# Altium project Gimbal.PrjPcb
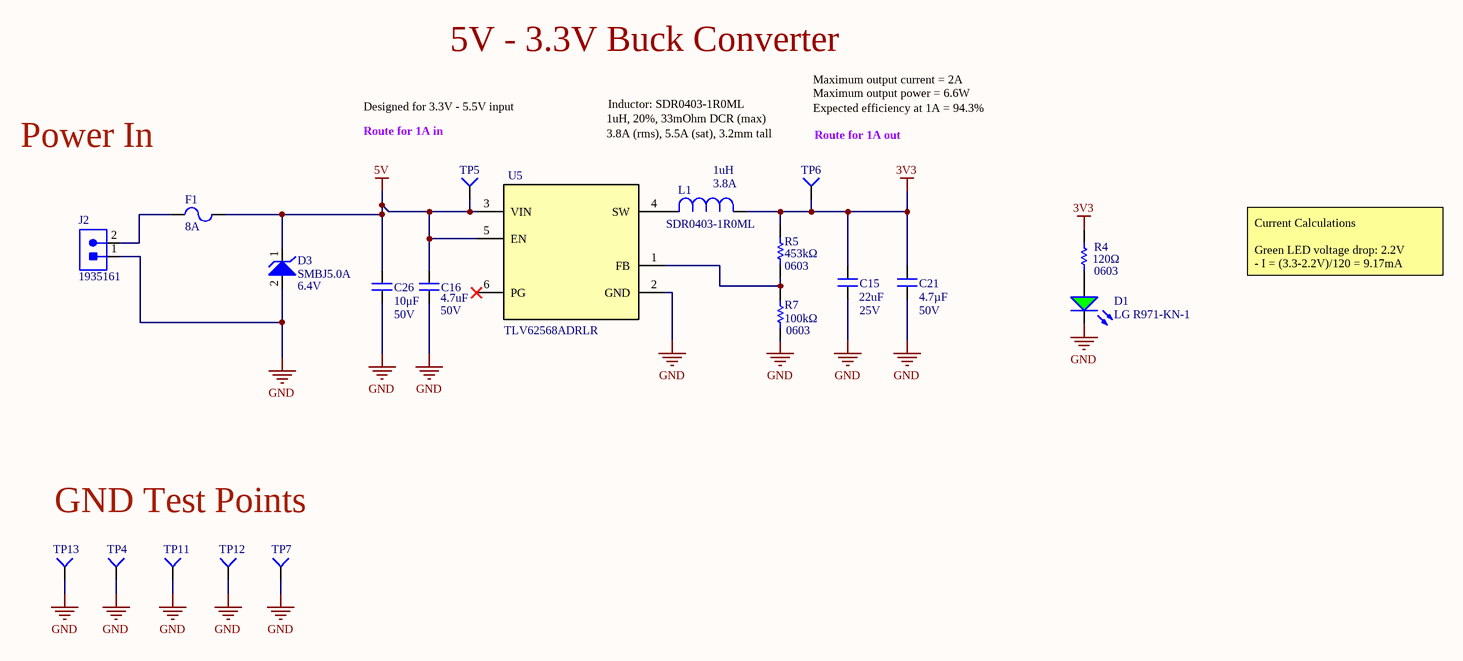
[diagram p0: SH1 - POWER.SchDoc]
5 sheets, 96 parts. Net scope: flat (ports and power ports of the same name join across sheets).
Board file: Gimbal.PcbDoc
Sheets:
  SH1 - POWER.SchDoc
  SH2 - CONNECTORS.SchDoc
  SH3 - SENSORS.SchDoc
  SH5 - MICROCONTROLLER.SchDoc
  SH6 - CAN.SchDoc

## Sheet SH1 - POWER.SchDoc: Power
size B; CheckedBy: Lance Bantoto; Author: Aidan Gratton; DrawnBy: Aidan Gratton; Engineer: Aidan Gratton; Organization: UW Robotics; Address1: 200 University Avenue; Address2: Waterloo; Address3: Ontario; Address4: Canada N2L 3G6; Revision: 2; SheetNumber: 1; SheetTotal: 6

### Parts
C15  Voltage: 25V  Capacitance: 22uF  [CAPC3225X270N]  (hidden comment: GRM32ER71E226ME15K)
C16  Voltage Rating: 50V  Capacitance: 4.7uF  [CAP1206]  (hidden comment: 4.7µF)
C21  4.7µF  Voltage: 50V  [CAP1206]
C26  value 10μF  Voltage Rating: 50V  [CAP1206]  (hidden comment: 10uF)
D1  LG R971-KN-1  [LED_0805_GREEN]
D3  Reverse Breakdown Voltage: 6.4V  [SMBJ5.0A]  (hidden comment: TVS_DIODE_UNIDIR_5V)
F1  Current Rating: 8A  [FUSE_1206]  (hidden comment: FUSE_8A_1206)
J2  1935161  [1935161]
L1  value 1uH  Manufacturer Part Number 1: SDR0403-1R0ML  Current Rating: 3.8A  [IND_BOURNS_SDR04]  (hidden comment: IND_1uH_3.8A)
R4  value 120Ω  Case Code (Imperial): 0603  [RESC0603(1608)_N]  (hidden comment: RES_120Ω_0603)
R5  value 453kΩ  Case Code (Imperial): 0603  [RESC0603(1608)_N]  (hidden comment: RES_453kΩ_0603)
R7  value 100kΩ  Case Code (Imperial): 0603  [RESC0603(1608)_N]  (hidden comment: RES_100kΩ_0603_1%)
TP4  TESTPOINT_1MM_SQUARE  [TESTPOINT_SQUARE_1MM]  (value not drawn)  (no BOM)
TP5  TESTPOINT_SMD_LOOP  [S1751-46R]  (value not drawn)
TP6  TESTPOINT_SMD_LOOP  [S1751-46R]  (value not drawn)
TP7  TESTPOINT_1MM_SQUARE  [TESTPOINT_SQUARE_1MM]  (value not drawn)  (no BOM)
TP11  TESTPOINT_1MM_SQUARE  [TESTPOINT_SQUARE_1MM]  (value not drawn)  (no BOM)
TP12  TESTPOINT_1MM_SQUARE  [TESTPOINT_SQUARE_1MM]  (value not drawn)  (no BOM)
TP13  TESTPOINT_SMD_LOOP  [S1751-46R]  (value not drawn)
U5  TLV62568ADRLR  [SOT50P160X60-6N]

### Nets
3V3: C15.2 C21.2 L1.2 R4.2 R5.2 TP6.1(=value)
5V: C16.2 C26.2 D3.1 F1.2 TP5.1(=value) U5.3(VIN) U5.5(EN)
GND: C15.1 C16.1 C21.1 C26.1 D1.2(K) D3.2 J2.1 R7.1 TP4.1(=value) TP7.1(=value) TP11.1(=value) TP12.1(=value) TP13.1(=value) U5.2(GND)
NetD1_1: D1.1(A) R4.1
NetF1_1: F1.1 J2.2
NetL1_1: L1.1 U5.4(SW)
NetR5_1: R5.1 R7.2 U5.1(FB)

Not connected (* = marked no-connect by the designer): U5 6(PG)*

### Notes on the sheet
- 5V - 3.3V Buck Converter
- Maximum output current = 2A
- Power In
- Designed for 3.3V - 5.5V input
- (near TP5) Route for 1A in
- 1uH, 20%, 33mOhm DCR (max)
- 3.8A (rms), 5.5A (sat), 3.2mm tall
- Inductor: SDR0403-1R0ML
- Maximum output power = 6.6W
- Expected efficiency at 1A = 94.3%
- (near TP6) Route for 1A out
- Current Calculations
  Green LED voltage drop: 2.2V
  - I = (3.3-2.2V)/120 = 9.17mA
- GND Test Points
- Title:
- Project:
- Date:
- Rev:
- Checker:
- Engineer:
- Sheet:
- of

### Library data of the parts
C15 = GRM32ER71E226ME15K: CAP CER 22UF 25V X7R 1210; Manufacturer 1: Murata Electronics; Tolerance: ±20%; Manufacturer Part Number 1: GRM32ER71E226ME15K; Supplier 1: Digi-Key; Supplier Part Number 1: 490-14682-1-ND; Package: 1210 (3225 Metric); Temperature Coefficient: X7R
C16 = CAP_4.7µF_50V_1206: CAP CER 4.7UF 50V X7R 1206; Manufacturer Part Number 1: GRM31CR71H475KA12L; Manufacturer 1: Murata; Tolerance: 10%; Material: Ceramic; Supplier Part Number 1: 490-6521-1-ND; Supplier 1: Digi-Key; Mount: Surface Mount; Case Code (Metric): 3216; Case Code (Imperial): 1206; Min Operating Temperature: -55°C; Max Operating Temperature: 125°C; Dielectric: X7R; Package: 1206 (3216 Metric); Voltage Rating (DC): 50V; Termination: SMD/SMT; Length: 3.2mm; Height: 1.6mm; Width: 0.063inch; Thickness: 0.071inch; Depth: 1.6mm; REACH SVHC: No SVHC; ComponentLink7URL: https://datasheet.ciiva.com/6270/partnumbering-e-01-6270217.pdf?src-supplier=Digi-Key; ComponentLink7Description: https://datasheet.ciiva.com/6270/partnumbering-e-01-6270217.pdf?src-supplier=Digi-Key; ComponentLink8URL: https://datasheet.ciiva.com/6270/partnumbering-e-01-6270218.pdf?src-supplier=Digi-Key; ComponentLink8Description: https://datasheet.ciiva.com/6270/partnumbering-e-01-6270218.pdf?src-supplier=Digi-Key; Voltage: 50V
C21 = CAP_4.7µF_50V_1206: CAP CER 4.7UF 50V X7R 1206; Manufacturer 1: Murata; Manufacturer Part Number 1: GRM31CR71H475KA12L; Material: Ceramic; Tolerance: 10%; Supplier 1: Digi-Key; Mount: Surface Mount; Package: 1206 (3216 Metric); Case Code (Metric): 3216; Case Code (Imperial): 1206; Min Operating Temperature: -55°C; Max Operating Temperature: 125°C; Capacitance: 4.7uF; Voltage Rating: 50V; Voltage Rating (DC): 50V; Termination: SMD/SMT; Dielectric: X7R; Length: 3.2mm; Height: 1.6mm; Width: 0.063inch; Thickness: 0.071inch; Depth: 1.6mm; REACH SVHC: No SVHC; ComponentLink7URL: https://datasheet.ciiva.com/6270/partnumbering-e-01-6270217.pdf?src-supplier=Digi-Key; ComponentLink7Description: https://datasheet.ciiva.com/6270/partnumbering-e-01-6270217.pdf?src-supplier=Digi-Key; ComponentLink8URL: https://datasheet.ciiva.com/6270/partnumbering-e-01-6270218.pdf?src-supplier=Digi-Key; ComponentLink8Description: https://datasheet.ciiva.com/6270/partnumbering-e-01-6270218.pdf?src-supplier=Digi-Key; Supplier Part Number 1: 490-6521-1-ND
C26 = CAP_10uF_50V_1206: CAP CER 10UF 50V X5R 1206; Manufacturer Part Number 1: GRT31CR61H106KE01L; Manufacturer 1: Murata; Dimensions: 0.126" L x 0.063" W (3.20mm x 1.6mm); Package: 1206 (3216 Metric); Supplier Part Number 1: 490-12456-1-ND; Supplier 1: Digi-Key; Mount: Surface Mount; Case Code (Imperial): 1206; Case Code (Metric): 3216; Dielectric: X5R; Manufacturer Part Numer 1: GRT31CR61H106KE01L
D1 = DIO_LED_G: LED GREEN DIFFUSED 0805 SMD; Manufacturer 1: OSRAM; Forward Voltage Drop: 2.2V; Package: 0805 (2012 Metric); Supplier Part Number 1: 475-1410-1-ND; Supplier 1: Digi-Key; Manufacturer Part Number 1: LG R971-KN-1; Mount: Surface Mount
D3 = TVS_DIODE_UNIDIR_5V: TVS DIODE 5V 9.2V DO214AA; Manufacturer 1: Bourns; Max Power Dissipation: 600W; Polarity: Unidirectional; Leakage Current: 800uA; Max Surge Current: 100A; Breakdown Voltage: 7.25V; Peak Pulse Current: 65.2A; Test Current: 10mA; Number of Channels: 1; Operating Supply Voltage: 3.5V; Power Line Protection: No; Supplier 1: Digi-Key; Mount: Surface Mount; Number of Pins: 2; Min Operating Temperature: -55°C; Max Operating Temperature: 150°C; Reverse Standoff Voltage: 5V; Min Breakdown Voltage: 6.4V; Clamping Voltage: 9.2V; Peak Pulse Power: 600W; Max Breakdown Voltage: 7.25V; Max Reverse Leakage Current: 800uA; Composition: Zener; Supplier Part Number 1: SMBJ5.0ABCT-ND; Manufacturer Part Number 1: SMBJ5.0A; Zener Voltage: *
F1 = FUSE_8A_1206: FUSE SMD 8A 24V; Manufacturer 1: Littelfuse; Manufacturer Part Number 1: 0469008.WR; Fuse Type: Board Mount (Cartridge Style Excluded); DC Cold Resistance: 31mR; Power Dissipation: 157.5mW; Approvals: UL,CSA; Supplier 1: Digi-Key; Mount: Surface Mount; Case/Package: 1206; Case Code (Imperial): 1206; Case Code (Metric): 3216; Housing Material: Ceramic; Min Operating Temperature: -55°C; Max Operating Temperature: 90°C; Voltage Rating (AC): 24V; Voltage Rating (DC): 24V; Current: 8A; Length: 3.18mm; Height: 0.023inch; Width: 0.06inch; Depth: 1.52mm; Supplier Part Number 1: F3542CT-ND
J2 = CON_2M_TERM: TERM BLK 2POS SIDE ENTRY 5MM; Manufacturer 1: Phoenix Contact; Connector Type: Screw; Voltage Rating (DC): 320V; Max Current Rating: 16A; Max Supply Voltage: 250V; Current Rating: 17.5A; Number of Poles: 2; Number of Levels: 1; Current: 18A; Voltage: 300V; Wire Gauge (Max): 26AWG; Wire Gauge (Min): 12AWG; Approvals: UL; Supplier 1: Digi-Key; Mount: Through Hole; Number of Pins: 2; Weight: 0.067021oz; Contact Material: Copper,Tin; Insulation Material: Nylon; Housing Material: Polyamide; Housing Color: Green; Color: Green; Material: Nylon; Number of Rows: 1; Voltage Rating: 250V; Number of Positions: 2; Number of Positions Per Level: 2; Termination: Solder; Number of Contacts: 2; Number of Circuits: 2; Orientation: Straight; Length: 9mm; Height: 11.3mm; Width: 14.9mm; Pitch: 5mm; Depth: 9mm; Wire/Cable Gauge: 26AWG; Flammability Rating: UL94 V-0; REACH SVHC: Unknown; Supplier Part Number 1: 277-1667-ND; Manufacturer Part Number 1: 1935161
L1 = IND_1uH_3.8A: FIXED IND 1UH 3.8A 33 MOHM SMD; Manufacturer 1: Bourns Inc.; Tolerance: ±20%; Supplier Part Number 1: SDR0403-1R0MLCT-ND; Supplier 1: Digi-Key
R4 = RES_120Ω_0603_5%: RES 120 OHM 5% 1/10W 0603; Manufacturer 1: Yageo; Manufacturer Part Number 1: RC0603JR-07120RL; Package: 0603 (1608 Metric); Dimensions: 0.063" L x 0.031" W (1.60mm x 0.80mm); Tolerance: 5%; Supplier Part Number 1: 311-120GRCT-ND; Supplier 1: Digi-Key; Mount: Surface Mount; Case Code (Metric): 1608
R5 = RES_453kΩ_0603_1%: RES 453K OHM 1% 1/10W 0603; Manufacturer 1: Panasonic Electronic Components; Manufacturer Part Number 1: ERJ-3EKF4533V; Package: 0603 (1608 Metric); Dimensions: 0.063" L x 0.031" W (1.60mm x 0.80mm); Supplier Part Number 1: P453KHCT-ND; Supplier 1: Digi-Key; Mount: Surface Mount; Case Code (Metric): 1608; Tolerance: 1%
R7 = RES_100kΩ_0603_1%: RES 100K OHM 1% 1/10W 0603; Manufacturer 1: Yageo; Manufacturer Part Number 1: RC0603FR-07100KL; Resistance: 10.2kR; Temperature Coefficient: 100ppm/°C; Max Power Dissipation: 125mW; Voltage Rating (DC): 150V; Package: 0603 (1608 Metric); Dimensions: 0.063" L x 0.031" W (1.60mm x 0.80mm); Supplier Part Number 1: 311-100KHRCT-ND; Supplier 1: Digi-Key; Mount: Surface Mount; Case Code (Metric): 1608; Tolerance: 1%; Case/Package: 0805; Supplier 2: Digi-Key; Manufacturer 2: Vishay; Manufacturer Part Number 2: CRCW080510K2FKEA; Stock 2: 7147; Pricing 2: 1=0.10000, 10=0.06200, 100=0.02540, 1000=0.01142, 2500=0.00991 (USD); Number of Pins: 2; Weight: 0.000194oz; Contact Plating: Tin; Min Operating Temperature: -55°C; Max Operating Temperature: 155°C; Composition: Thick Film; Number of Terminations: 2; Power Rating: 125mW; Voltage Rating: 150V; Termination: SMD/SMT; Features: Automotive AEC-Q200; Military Standard: Not; Working Voltage: 150V; Length: 2mm; Height: 0.45mm; Width: 0.049inch; Depth: 1.25mm; REACH SVHC: Unknown; ComponentLink7URL: https://datasheet.ciiva.com/22702/1697337-22702902.pdf?src-supplier=Element14; ComponentLink7Description: https://datasheet.ciiva.com/22702/1697337-22702902.pdf?src-supplier=Element14; ComponentLink8URL: https://datasheet.ciiva.com/16204/dcrcwe3-16204135.pdf?src-supplier=Future+Electronics; ComponentLink8Description: https://datasheet.ciiva.com/16204/dcrcwe3-16204135.pdf?src-supplier=Future+Electronics; ComponentLink9URL: https://datasheet.ciiva.com/16852/dcrcwe3-16852825.pdf?src-supplier=Avnet+Europe; ComponentLink9Description: https://datasheet.ciiva.com/16852/dcrcwe3-16852825.pdf?src-supplier=Avnet+Europe; ComponentLink10URL: https://datasheet.ciiva.com/7663/1697337-7663915.pdf?src-supplier=Element14; ComponentLink10Description: https://datasheet.ciiva.com/7663/1697337-7663915.pdf?src-supplier=Element14; ComponentLink11URL: https://datasheet.ciiva.com/7663/1697337-7663916.pdf?src-supplier=Element14; ComponentLink11Description: https://datasheet.ciiva.com/7663/1697337-7663916.pdf?src-supplier=Element14; ComponentLink12URL: https://datasheet.ciiva.com/22674/1825492-22674606.pdf?src-supplier=Element14; ComponentLink12Description: https://datasheet.ciiva.com/22674/1825492-22674606.pdf?src-supplier=Element14; ComponentLink13URL: https://datasheet.ciiva.com/3258/dcrcwe3-3258031.pdf?src-supplier=Avnet; ComponentLink13Description: https://datasheet.ciiva.com/3258/dcrcwe3-3258031.pdf?src-supplier=Avnet; Supplier Part Number 2: 541-10.2KCCT-ND
TP4 TP7 TP11 TP12 = TESTPOINT_1MM_SQUARE: TESTPOINT 1MM SQUARE; Part Number (MPN): *
TP5 TP6 TP13 = TESTPOINT_SMD_LOOP: PC TEST POINT SMD; Manufacturer 1: Harwin; Plating: Tin; Number of Ports: 1; Supplier 1: Digi-Key; Manufacturer Part Number 1: S1751-46R; RoHS: Yes; Category: Terminal Blocks; Stock 1: 159143; Pricing 1: 1=0.29000, 10=0.27700, 25=0.23760, 50=0.20200, 100=0.19400, 250=0.17424, 500=0.16632, 1000=0.13860 (USD); Mount: Surface Mount; Material: Brass,Copper Alloy; Contact Material: Copper,Copper Alloy; Contact Plating: Tin; Color: Natural; Termination: Solder; Orientation: Straight; Number of Contacts: 1; Package Quantity: 2500; Packaging: Tape and Reel; Length: 3.25mm; Height: 2mm; Depth: 2mm; Width: 1.65mm; Radiation Hardening: No; REACH SVHC: No SVHC; ComponentLink1URL: https://datasheet.ciiva.com:443/pdfs/VipMasterIC/IC/HRWN/HRWN-S-A0002541722/HRWN-S-A0004513972-1.pdf?src-supplier=IHS+Markit; ComponentLink1Description: https://datasheet.ciiva.com:443/pdfs/VipMasterIC/IC/HRWN/HRWN-S-A0002541722/HRWN-S-A0004513972-1.pdf?src-supplier=IHS+Markit; ComponentLink2URL: https://datasheet.ciiva.com/5224/2010page161-58228-5224784.pdf?src-supplier=Mouser; ComponentLink2Description: https://datasheet.ciiva.com/5224/2010page161-58228-5224784.pdf?src-supplier=Mouser; ComponentLink3URL: https://datasheet.ciiva.com/22631/1688119-22631153.pdf?src-supplier=Element14; ComponentLink3Description: https://datasheet.ciiva.com/22631/1688119-22631153.pdf?src-supplier=Element14; ComponentLink4URL: https://datasheet.ciiva.com/2917/s1751-2917604.pdf?src-supplier=Digi-Key; ComponentLink4Description: https://datasheet.ciiva.com/2917/s1751-2917604.pdf?src-supplier=Digi-Key; ComponentLink5URL: https://datasheet.ciiva.com/1462/1693781-1462652.pdf?src-supplier=Farnell; ComponentLink5Description: https://datasheet.ciiva.com/1462/1693781-1462652.pdf?src-supplier=Farnell; ComponentLink6URL: https://datasheet.ciiva.com/1454/1693781-1454941.pdf?src-supplier=Element14; ComponentLink6Description: https://datasheet.ciiva.com/1454/1693781-1454941.pdf?src-supplier=Element14; Supplier Part Number 1: 952-1478-1-ND
U5 = TLV62568ADRLR: IC REG BUCK ADJUSTABLE 2A SOT563; Manufacturer 1: Texas Instruments; Vin (Min): 2.5V; Vin (Max): 5.5V; Vout (Min/Fixed): 0.6V; Iout: 1A; Switching Frequency: 1.5MHz; Manufacturer Part Number 1: TLV62568ADRLR; Supplier 1: Digi-Key; Supplier Part Number 1: 296-50407-1-ND; Vout (Max): 5.5V; Package: SOT-563, SOT-666; Iout (Max): 2A

## Sheet SH2 - CONNECTORS.SchDoc: Connectors
size B; CheckedBy: Lance Bantoto; Author: Aidan Gratton; DrawnBy: Aidan Gratton; Engineer: Aidan Gratton; Organization: UW Robotics; Address1: 200 University Avenue; Address2: Waterloo; Address3: Ontario; Address4: Canada N2L 3G6; Revision: 2; SheetNumber: 2; SheetTotal: 6
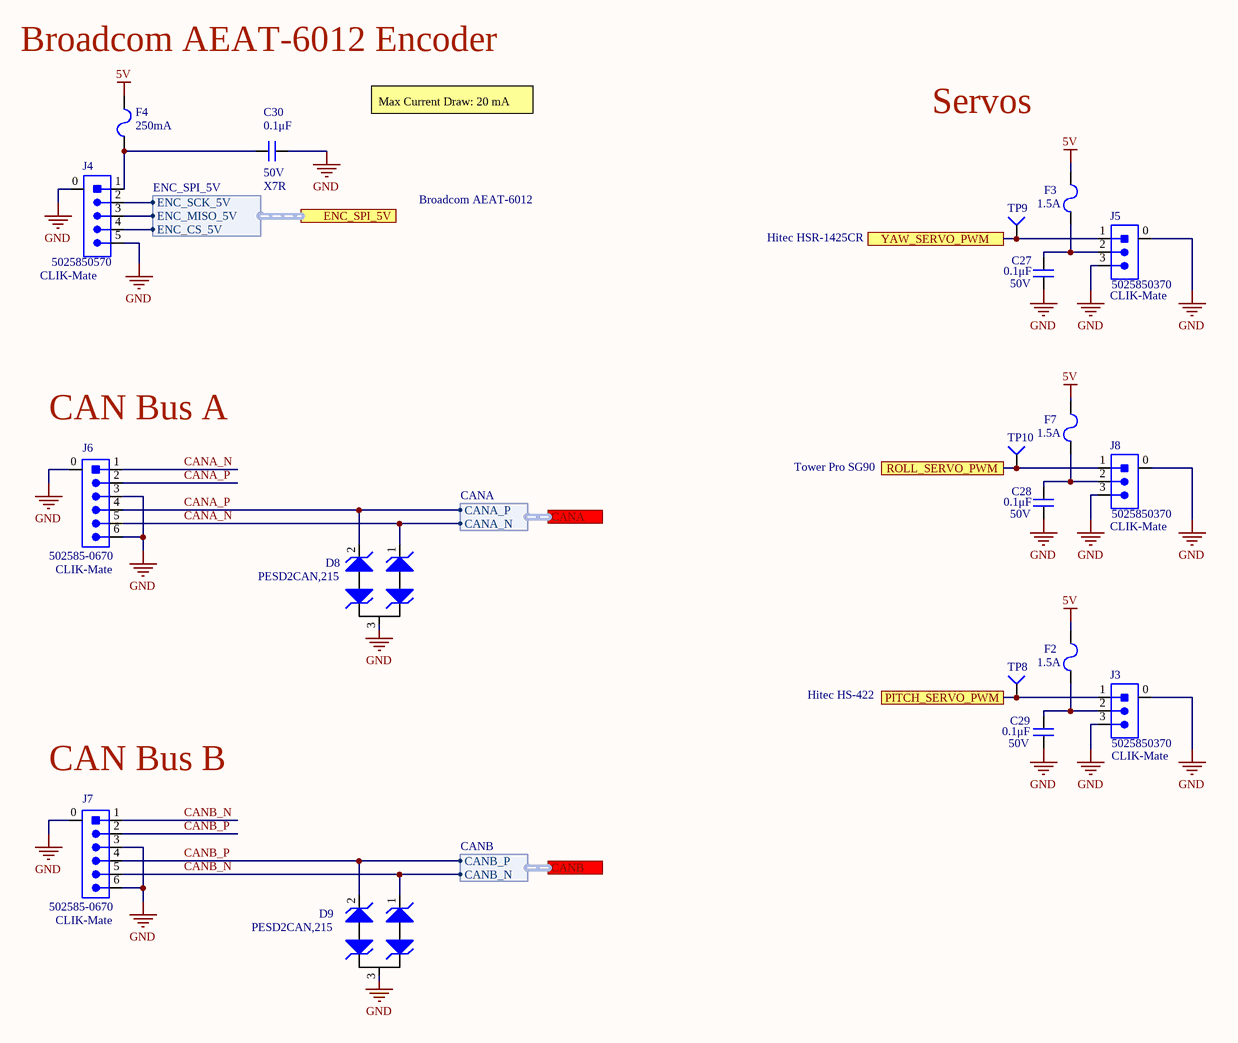
[diagram p1: SH2 - CONNECTORS.SchDoc]

### Parts
C27  value 0.1μF  Voltage Rating: 50V  [CAP0603]  (hidden comment: CAP_0.1uF_50V_0603)
C28  value 0.1μF  Voltage Rating: 50V  [CAP0603]  (hidden comment: CAP_0.1uF_50V_0603)
C29  value 0.1μF  Voltage Rating: 50V  [CAP0603]  (hidden comment: CAP_0.1uF_50V_0603)
C30  value 0.1μF  Dielectric: X7R  Voltage Rating: 50V  [CAP0603]  (hidden comment: CAP_0.1uF_50V_0603)
D8  Manufacturer Part Number 1: PESD2CAN,215  [TVS_DIODE_CAN]  (hidden comment: TVS_DIODE_CAN)
D9  Manufacturer Part Number 1: PESD2CAN,215  [TVS_DIODE_CAN]  (hidden comment: TVS_DIODE_CAN)
F2  Current Rating: 1.5A  [FUSE_1206]  (hidden comment: FUSE_1.5A_1206)
F3  Current Rating: 1.5A  [FUSE_1206]  (hidden comment: FUSE_1.5A_1206)
F4  Current Rating: 250mA  [FUSE_0603]  (hidden comment: FUSE_250mA_0603)
F7  Current Rating: 1.5A  [FUSE_1206]  (hidden comment: FUSE_1.5A_1206)
J3  Manufacturer Part Number 1: 5025850370  Family: CLIK-Mate  [MOLEX-5025850370]  (hidden comment: CON_3M_SM_RA)
J4  Manufacturer Part Number 1: 5025850570  Family: CLIK-Mate  [MOLEX-5025850570]  (hidden comment: CON_5M_SM_RA)
J5  Manufacturer Part Number 1: 5025850370  Family: CLIK-Mate  [MOLEX-5025850370]  (hidden comment: CON_3M_SM_RA)
J6  Family: CLIK-Mate  Manufactor Number: 502585-0670  [MOLEX-5025850670]  (hidden comment: CON_6M_SM_RA_1.5mm)
J7  Family: CLIK-Mate  Manufactor Number: 502585-0670  [MOLEX-5025850670]  (hidden comment: CON_6M_SM_RA_1.5mm)
J8  Manufacturer Part Number 1: 5025850370  Family: CLIK-Mate  [MOLEX-5025850370]  (hidden comment: CON_3M_SM_RA)
TP8  TESTPOINT_1MM_CIRCLE  [TESTPOINT_CIRCLE_1MM]  (value not drawn)  (no BOM)
TP9  TESTPOINT_1MM_CIRCLE  [TESTPOINT_CIRCLE_1MM]  (value not drawn)  (no BOM)
TP10  TESTPOINT_1MM_CIRCLE  [TESTPOINT_CIRCLE_1MM]  (value not drawn)  (no BOM)

### Ports
CANA (harness CANA), CANB (harness CANB), ENC_SPI_5V (harness ENC_SPI_5V), PITCH_SERVO_PWM, ROLL_SERVO_PWM, YAW_SERVO_PWM

### Harnesses
CANB: CANB_P, CANB_N
CANA: CANA_P, CANA_N
ENC_SPI_5V: ENC_MISO_5V, ENC_CS_5V, ENC_SCK_5V

### Nets
5V: F2.2 F3.2 F4.2 F7.2
GND: C27.1 C28.1 C29.1 C30.1 D8.3 D9.3 J3.0 J3.3 J4.0 J4.5 J5.0 J5.3 J6.0 J6.3 J6.6 J7.0 J7.3 J7.6 J8.0 J8.3
CANA_N: D8.1 J6.1 J6.5 ; port CANA.CANA_N
CANA_P: D8.2 J6.2 J6.4 ; port CANA.CANA_P
CANB_N: D9.1 J7.1 J7.5 ; port CANB.CANB_N
CANB_P: D9.2 J7.2 J7.4 ; port CANB.CANB_P
PITCH_SERVO_PWM: J3.1 TP8.1(=value) ; port PITCH_SERVO_PWM
ROLL_SERVO_PWM: J8.1 TP10.1(=value) ; port ROLL_SERVO_PWM
YAW_SERVO_PWM: J5.1 TP9.1(=value) ; port YAW_SERVO_PWM
NetC27_2: C27.2 F3.1 J5.2
NetC28_2: C28.2 F7.1 J8.2
NetC29_2: C29.2 F2.1 J3.2
NetC30_2: C30.2 F4.1 J4.1
NetJ4_2: J4.2 ; port ENC_SPI_5V.ENC_SCK_5V
NetJ4_3: J4.3 ; port ENC_SPI_5V.ENC_MISO_5V
NetJ4_4: J4.4 ; port ENC_SPI_5V.ENC_CS_5V

### Notes on the sheet
- (near F4) Broadcom AEAT-6012 Encoder
- Max Current Draw: 20 mA
- Servos
- Broadcom AEAT-6012
- Hitec HSR-1425CR
- (near J6) CAN Bus A
- Tower Pro SG90
- Hitec HS-422
- (near J7) CAN Bus B
- Title:
- Project:
- Date:
- Rev:
- Checker:
- Engineer:
- Sheet:
- of

### Library data of the parts
C27-C30 = CAP_0.1uF_50V_0603: CAP CER 0.1UF 50V X7R 0603; Manufacturer Part Number 1: CC0603KRX7R9BB104; Manufacturer 1: Yageo; Package/Footprint: 0603; Temperature Coefficient: X7R; Supplier Part Number 1: 311-1344-1-ND; Supplier 1: Digi-Key; Mounting Type: SMD
  C27-C29: Dielectric: X7R
D8 D9 = TVS_DIODE_CAN: TVS DIODE 24V 41V SOT323-3; Manufacturer 1: Nexperia USA Inc.; Supplier Part Number 1: 1727-3891-1-ND; Supplier 1: Digi-Key; Package/Footprint: SOT323-3; Mounting Type: Surface Mount
F2 F3 F7 = FUSE_1.5A_1206: FUSE SMD 1.5A 63V; Manufacturer 1: Littelfuse; Manufacturer Part Number 1: 046601.5NR; Fuse Type: Board Mount (Cartridge Style Excluded); DC Cold Resistance: 31mR; Power Dissipation: 157.5mW; Approvals: UL,CSA; Package/Footprint: 1206; Supplier 1: Digi-Key; Housing Material: Ceramic; Min Operating Temperature: -55°C; Max Operating Temperature: 90°C; Voltage Rating (AC): 63V; Voltage Rating (DC): 63V; Current: 1.5A; Length: 3.18mm; Height: 0.023inch; Width: 0.06inch; Depth: 1.52mm; Supplier Part Number 1: F1462CT-ND; Mounting Type: SMD
F4 = FUSE_250mA_0603: FUSE SMD 250mA 32V; Manufacturer 1: Littelfuse; Manufacturer Part Number 1: 0467.250NRHF; Response Time: Fast Blow; Package/Footprint: 0603; Voltage Rating (AC): 32V; Voltage Rating (DC): 32V; Supplier 1: Digi-Key; Supplier Packaging 1: Cut Tape; Supplier Part Number 1: F6020CT-ND; Mounting Type: SMD
J3 J5 J8 = CON_3M_SM_RA: CONN RCPT 3POS 0.059 TIN SMD R/A; Manufacturer 1: Molex; Number of Contacts: 3; Current Rating: 2A; Voltage Rating: 100V; Connector Type: Receptacle,Center Strip Contact; Gender: Female; Contact Resistance: 20mR; Pitch: 1.5mm; Glow Wire Compliant: Non-compliant; Supplier 1: Digi-Key; Category: Headers and Wire Housings; Stock 2: 133; Pricing 2: 1=0.53000, 10=0.50100, 100=0.38380, 500=0.33374 (USD); Contact Plating: Tin; Color: Beige; Housing Material: Thermoplastic; Contact Material: Copper Alloy; Min Operating Temperature: -40°C; Max Operating Temperature: 85°C; Number of Rows: 1; Termination: Solder; Orientation: Right Angle; Fastening Type: Latch; Number of Positions: 3; Number of Circuits: 3; Contact Gender: Female; Length: 8.8mm; Depth: 7.3mm; REACH SVHC: No SVHC; Supplier Part Number 1: WM12831CT-ND; Mounting Type: SMD; Package/Footprint: SMD
J4 = CON_5M_SM_RA: CONN HEADER SMD RIGHT ANGLE 1.5MM PITCH; Manufacturer 1: Molex; Connector Type: Receptacle,Center Strip Contact; Number of Positions: 5; Current Rating: 2A; Supplier 1: Digi-Key; Termination: Solder; Number of Contacts: 5; Orientation: Right Angle; Number of Circuits: 5; Number of Rows: 1; Supplier Part Number 1: WM14469CT-ND; Mounting Type: SMD; Package/Footprint: SMD
J6 J7 = CON_6M_SM_RA_1.5mm: CONN HEADER SMD RIGHT ANGLE 1.5 MM PITCH; Manufacturer: Molex; Supplier 1: Digi-Key; Supplier Part Number 1: WM12832CT-ND; Package/Footprint: SMD; Mounting Type: SMD
TP8-TP10 = TESTPOINT_1MM_CIRCLE: TESTPOINT 1MM CIRCLE; Part Number (MPN): *

## Sheet SH3 - SENSORS.SchDoc: Sensors
size B; CheckedBy: Lance Bantoto; Author: Aidan Gratton; Engineer: Aidan Gratton; Organization: UW Robotics; Address1: 200 University Avenue; Address2: Waterloo; Address3: Ontario; Address4: Canada N2L 3G6; Revision: 2; SheetNumber: 3; SheetTotal: 6
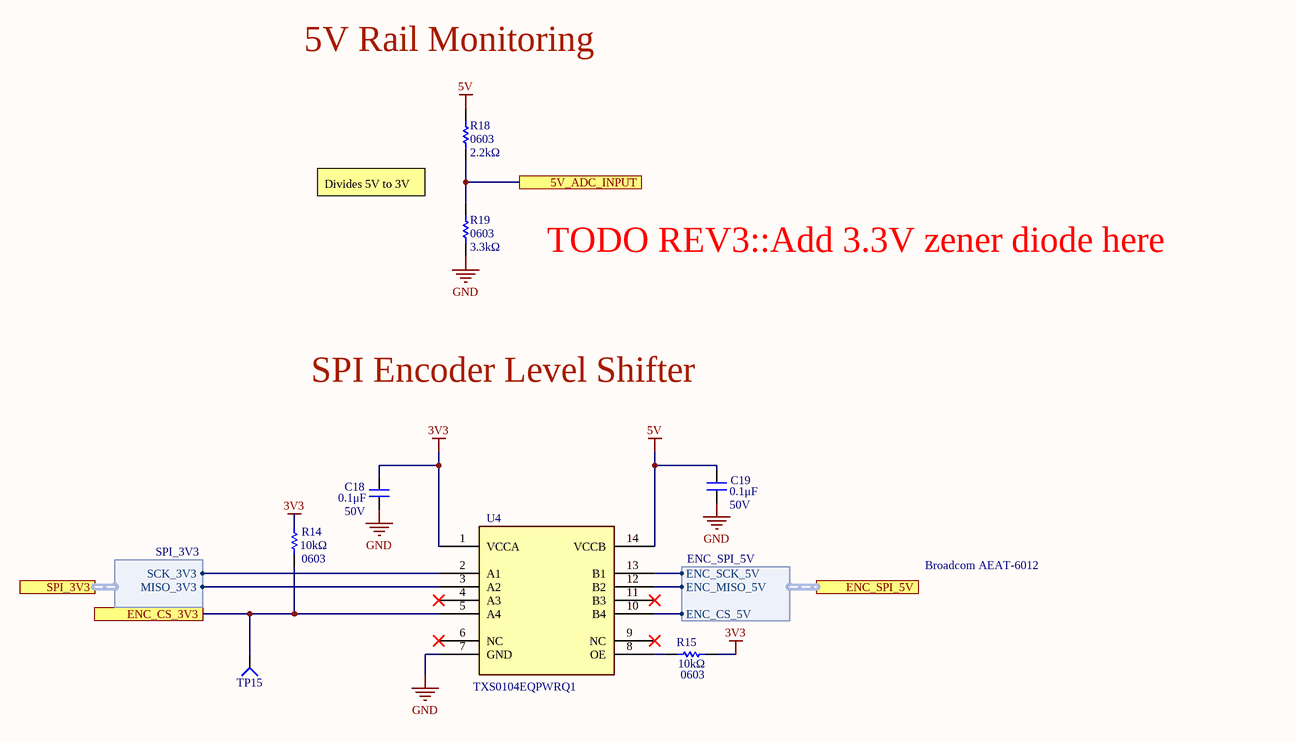
[diagram p2: SH3 - SENSORS.SchDoc]

### Parts
C18  value 0.1μF  Voltage Rating: 50V  [CAP0603]  (hidden comment: CAP_0.1uF_50V_0603)
C19  value 0.1μF  Voltage Rating: 50V  [CAP0603]  (hidden comment: CAP_0.1uF_50V_0603)
R14  value 10kΩ  Case Code (Imperial): 0603  [RESC0603(1608)_N]  (hidden comment: RES_10kΩ_0603)
R15  value 10kΩ  Case Code (Imperial): 0603  [RESC0603(1608)_N]  (hidden comment: RES_10kΩ_0603)
R18  value 2.2kΩ  Case Code (Imperial): 0603  [RESC0603(1608)_N]  (hidden comment: RES_2.2kΩ_0603)
R19  value 3.3kΩ  Case Code (Imperial): 0603  [RESC0603(1608)_N]  (hidden comment: RES_3.3kΩ_0603)
TP15  TESTPOINT_1MM_CIRCLE  [TESTPOINT_CIRCLE_1MM]  (value not drawn)  (no BOM)
U4  TXS0104EQPWRQ1  [TXS0104EQPWRQ1]

### Ports
5V_ADC_INPUT, ENC_CS_3V3, ENC_SPI_5V (harness ENC_SPI_5V), SPI_3V3 (harness SPI_3V3)

### Harnesses
SPI_3V3: MISO_3V3, SCK_3V3
ENC_SPI_5V: ENC_MISO_5V, ENC_CS_5V, ENC_SCK_5V

### Nets
3V3: C18.2 R14.2 R15.2 U4.1(VCCA)
5V: C19.2 R18.2 U4.14(VCCB)
GND: C18.1 C19.1 R19.1 U4.7(GND)
5V_ADC_INPUT: R18.1 R19.2 ; port 5V_ADC_INPUT
ENC_CS_3V3: R14.1 TP15.1(=value) U4.5(A4) ; port ENC_CS_3V3
NetJ4_2: U4.13(B1) ; port ENC_SPI_5V.ENC_SCK_5V
NetJ4_3: U4.12(B2) ; port ENC_SPI_5V.ENC_MISO_5V
NetJ4_4: U4.10(B4) ; port ENC_SPI_5V.ENC_CS_5V
NetR13_1: U4.2(A1) ; port SPI_3V3.SCK_3V3
NetR15_1: R15.1 U4.8(OE)
NetTP2_1: U4.3(A2) ; port SPI_3V3.MISO_3V3

Not connected (* = marked no-connect by the designer): U4 4(A3)* 6(NC)* 9(NC)* 11(B3)*

### Notes on the sheet
- 5V Rail Monitoring
- Divides 5V to 3V
- TODO REV3::Add 3.3V zener diode here
- SPI Encoder Level Shifter
- Broadcom AEAT-6012
- Title:
- Project:
- Date:
- Rev:
- Checker:
- Engineer:
- Sheet:
- of

### Library data of the parts
C18 C19 = CAP_0.1uF_50V_0603: CAP CER 0.1UF 50V X7R 0603; Manufacturer Part Number 1: CC0603KRX7R9BB104; Manufacturer 1: Yageo; Dimensions: 0.063" L x 0.031" W (1.60mm x 0.80mm); Package: 0603 (1608 Metric); Temperature Coefficient: X7R; Supplier Part Number 1: 311-1344-1-ND; Supplier 1: Digi-Key; Mount: Surface Mount; Case Code (Imperial): 0603; Case Code (Metric): 1608; Dielectric: X7R
R14 R15 = RES_10kΩ_0603_5%: RES 10K OHM 5% 1/10W 0603; Manufacturer Part Number 1: RC0603JR-0710KL; Manufacturer 1: Yageo; Package: 0603 (1608 Metric); Dimensions: 0.063" L x 0.031" W (1.60mm x 0.80mm); Tolerance: 5%; Supplier Part Number 1: 311-10KGRCT-ND; Supplier 1: Digi-Key; Mount: Surface Mount; Case Code (Metric): 1608
R18 = RES_2.2kΩ_0603_1%: RES 2.2K OHM 1% 1/10W 0603; Manufacturer 1: Yageo; Manufacturer Part Number 1: RC0603FR-072K2L; Dimensions: 0.063" L x 0.031" W (1.60mm x 0.80mm); Package: 0603 (1608 Metric); Supplier Part Number 1: 311-2.20KHRCT-ND; Supplier 1: Digi-Key; Mount: Surface Mount; Case Code (Metric): 1608; Tolerance: 1%
R19 = RES_3.3kΩ_0603_5%: RES 3.3K OHM 5% 1/10W 0603; Manufacturer 1: Yageo; Manufacturer Part Number 1: RC0603JR-073K3L; Dimensions: 0.063" L x 0.031" W (1.60mm x 0.80mm); Package: 0603 (1608 Metric); Supplier 1: Digi-Key; Supplier Part Number 1: 311-3.3KGRCT-ND; Mount: Surface Mount; Case Code (Metric): 1608; Tolerance: 5%
TP15 = TESTPOINT_1MM_CIRCLE: TESTPOINT 1MM CIRCLE; Part Number (MPN): *
U4 = IC_LVL_SHIFTER_4_CH: IC BIDIRECTIONAL LEVEL SHIFTER 4 CHANNEL 14TSSOP; Manufacturer: Texas Instruments; VCCB Max: 5V5 MAX; VCCA Max: 3V6 MAX; Data Rate: 24Mbps; VCCA Voltage: 1.65 V ~ 3.6 V; VCCB Voltage: 2.3 V ~ 5.5 V; Supplier 1: Digi-Key; Supplier Part Number 1: 296-41034-1-ND; Package: 14-TSSOP; MPN: TXS0104EQPWRQ1; Mount: Surface Mount; Min Operating Temperature: -40°C; Max Operating Temperature: 125°C

## Sheet SH5 - MICROCONTROLLER.SchDoc: Microcontroller
size B; CheckedBy: Lance Bantoto; Engineer: Aidan Gratton; Organization: UW Robotics; Address1: 200 University Avenue; Address2: Waterloo; Address3: Ontario; Address4: Canada N2L 3G6; Revision: 2; SheetNumber: 5; SheetTotal: 6
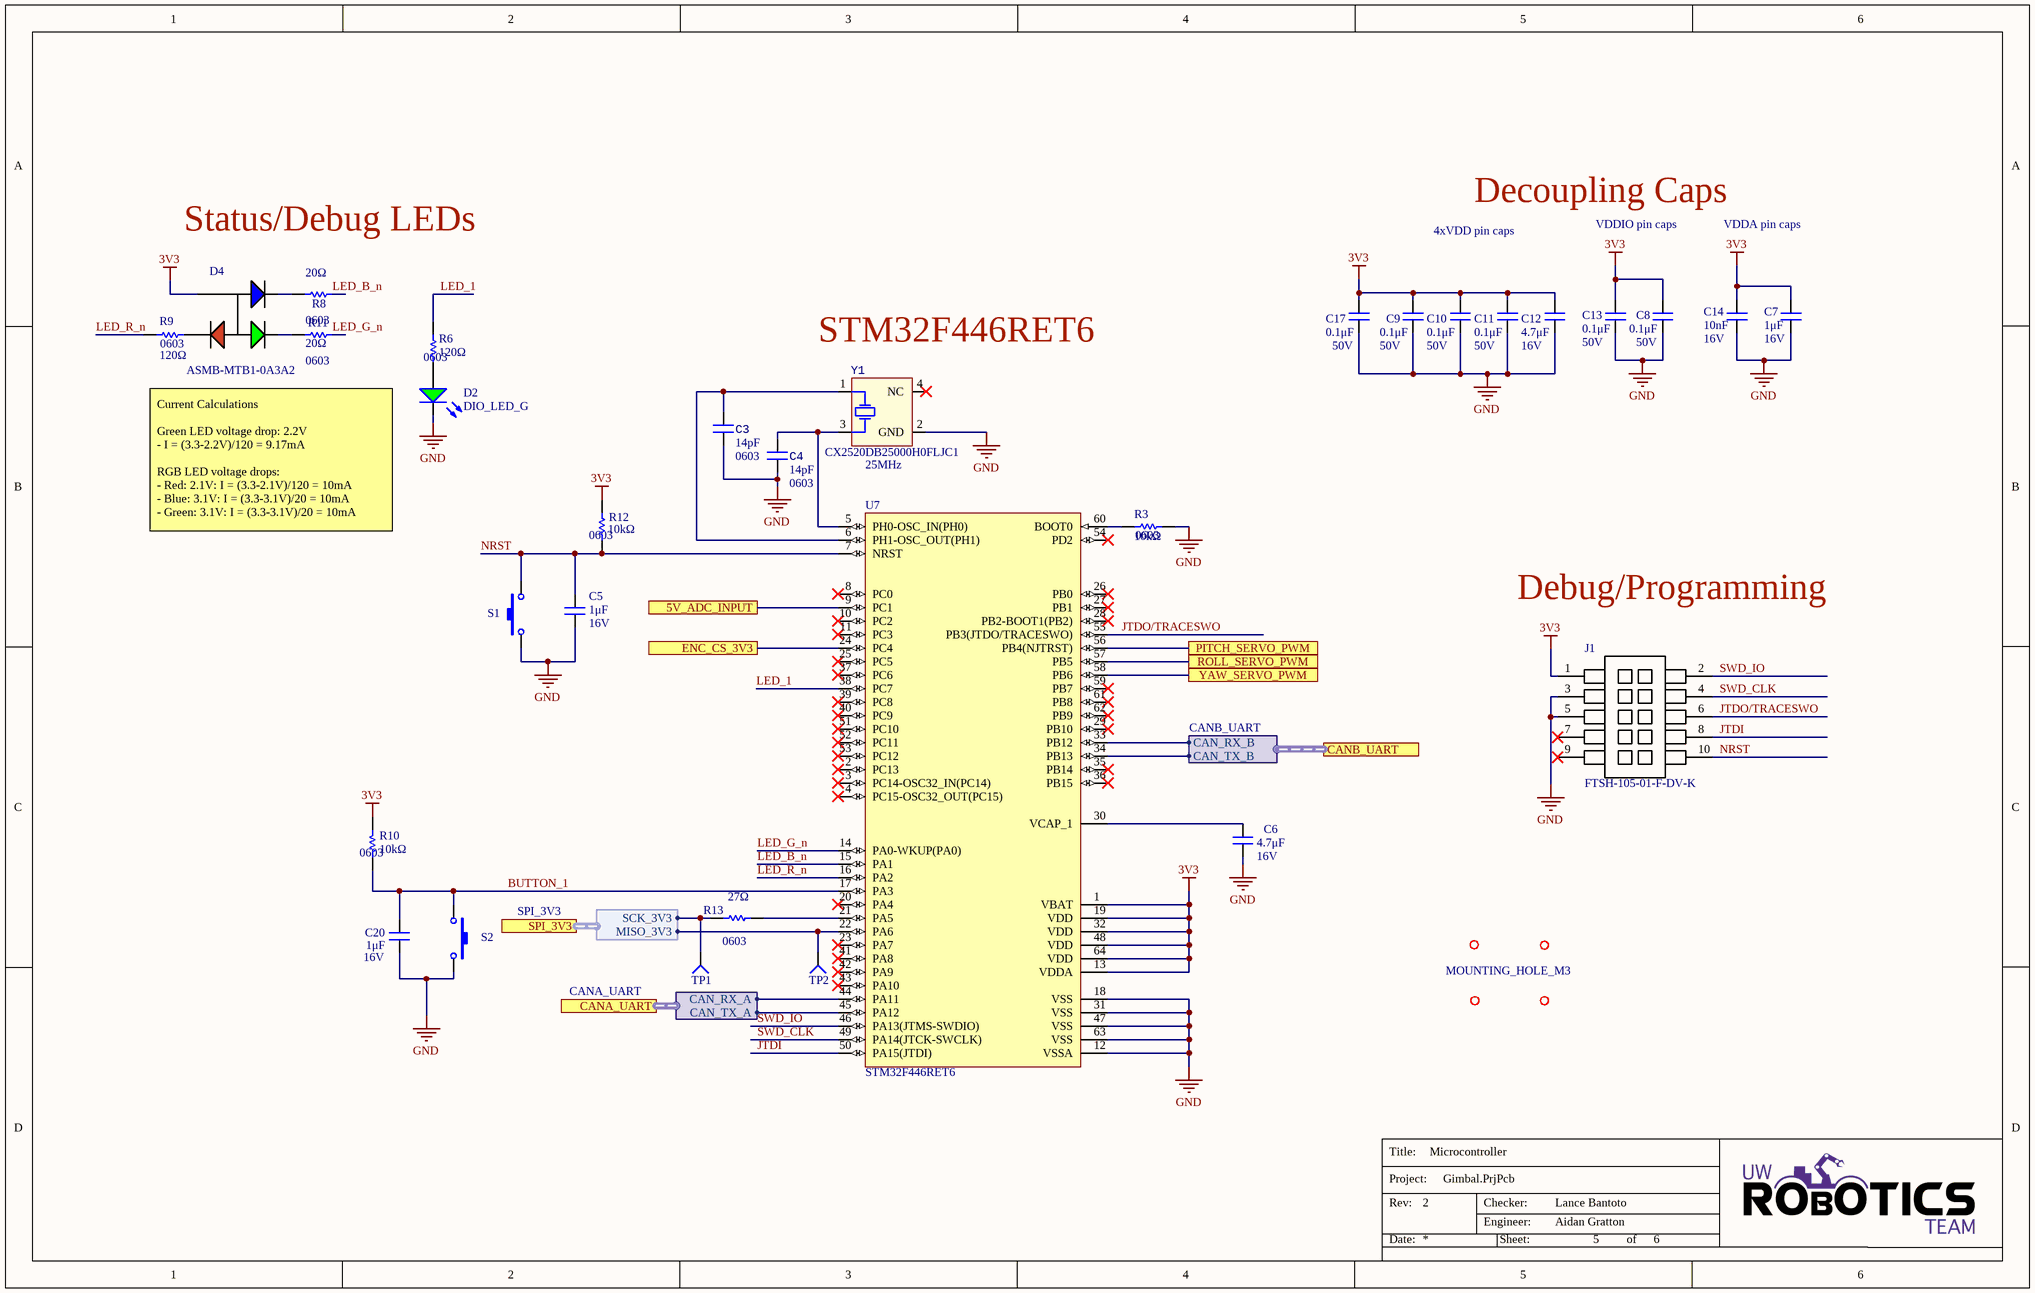
[diagram p3: SH5 - MICROCONTROLLER.SchDoc]

### Parts
C3  value 14pF  Package/Footprint: 0603  [CAP0603]  (hidden comment: CAP_14pF_50V_0603)
C4  value 14pF  Package/Footprint: 0603  [CAP0603]  (hidden comment: CAP_14pF_50V_0603)
C5  value 1μF  Voltage Rating: 16V  [CAP2012]  (hidden comment: CAP_1uF_16V_0805)
C6  value 4.7μF  Voltage Rating: 16V  [CAP2012]  (hidden comment: CAP_4.7uF_16V_0805)
C7  value 1μF  Voltage Rating: 16V  [CAP0603]  (hidden comment: CAP_1uF_16V_0603)
C8  value 0.1μF  Voltage Rating: 50V  [CAP0603]  (hidden comment: CAP_0.1uF_50V_0603)
C9  value 0.1μF  Voltage Rating: 50V  [CAP0603]  (hidden comment: CAP_0.1uF_50V_0603)
C10  value 0.1μF  Voltage Rating: 50V  [CAP0603]  (hidden comment: CAP_0.1uF_50V_0603)
C11  value 0.1μF  Voltage Rating: 50V  [CAP0603]  (hidden comment: CAP_0.1uF_50V_0603)
C12  value 4.7μF  Voltage Rating: 16V  [CAP2012]  (hidden comment: CAP_4.7uF_16V_0805)
C13  value 0.1μF  Voltage Rating: 50V  [CAP0603]  (hidden comment: CAP_0.1uF_50V_0603)
C14  value 10nF  Voltage Rating: 16V  [CAP0603]  (hidden comment: CAP_10nF_0603)
C17  value 0.1μF  Voltage Rating: 50V  [CAP0603]  (hidden comment: CAP_0.1uF_50V_0603)
C20  value 1μF  Voltage Rating: 16V  [CAP2012]  (hidden comment: CAP_1uF_16V_0805)
D2  DIO_LED_G  [LED_0805_GREEN]
D4  Manufacturer Part Number 1: ASMB-MTB1-0A3A2  [LED_RGB]  (hidden comment: LED_RGB)
J1  Manufacturer Part Number 1: FTSH-105-01-F-DV-K  [FTSH-105-01-F-DV-K-P-TR]  (hidden comment: CON_PROGRAMMING)
MH1  MOUNTING_HOLE_M3  [MOUNTING_HOLE_3mm_GIMBAL_REV2]  (value not drawn)  (no BOM)
MH2  MOUNTING_HOLE_M3  [MOUNTING_HOLE_3mm_GIMBAL_REV2]  (value not drawn)  (no BOM)
MH3  MOUNTING_HOLE_M3  [MOUNTING_HOLE_3mm_GIMBAL_REV2]  (value not drawn)  (no BOM)
MH4  MOUNTING_HOLE_M3  [MOUNTING_HOLE_3mm_GIMBAL_REV2]  (no BOM)
R3  value 10kΩ  Package/Footprint: 0603  [RESC0603]  (hidden comment: RES_10kΩ_0603_5%)
R6  value 120Ω  Package/Footprint: 0603  [RESC0603]  (hidden comment: RES_120Ω_0603)
R8  value 20Ω  Package/Footprint: 0603  [RESC0603]  (hidden comment: RES_20Ω_0603_5%)
R9  value 120Ω  Package/Footprint: 0603  [RESC0603]  (hidden comment: RES_120Ω_0603)
R10  value 10kΩ  Package/Footprint: 0603  [RESC0603]  (hidden comment: RES_10kΩ_0603_5%)
R11  value 20Ω  Package/Footprint: 0603  [RESC0603]  (hidden comment: RES_20Ω_0603_5%)
R12  value 10kΩ  Package/Footprint: 0603  [RESC0603]  (hidden comment: RES_10kΩ_0603_5%)
R13  Resistance: 27Ω  Package/Footprint: 0603  [RESC0603]  (hidden comment: RES_27Ω_0603_5%)
S1  SW_TACTILE  [B3U-1000P]  (value not drawn)
S2  SW_TACTILE  [B3U-1000P]  (value not drawn)
TP1  TESTPOINT_1MM_CIRCLE  [TESTPOINT_CIRCLE_1MM]  (value not drawn)  (no BOM)
TP2  TESTPOINT_1MM_CIRCLE  [TESTPOINT_CIRCLE_1MM]  (value not drawn)  (no BOM)
U7  STM32F446RET6  [STM-LQFP64_L]
Y1  Manufacturer Part Number 1: CX2520DB25000H0FLJC1  Frequency: 25MHz  [SOIC254P1016X440-4N]  (hidden comment: CRYSTAL_25MHZ)

### Ports
5V_ADC_INPUT, CANA_UART (harness CANA_UART), CANB_UART (harness CANB_UART), ENC_CS_3V3, PITCH_SERVO_PWM, ROLL_SERVO_PWM, SPI_3V3 (harness SPI_3V3), YAW_SERVO_PWM

### Harnesses
CANA_UART: CAN_RX_A, CAN_TX_A
CANB_UART: CAN_RX_B, CAN_TX_B
SPI_3V3: SCK_3V3, MISO_3V3

### Nets
3V3: C7.2 C8.2 C9.2 C10.2 C11.2 C12.2 C13.2 C14.2 C17.2 D4.4(COMMON_ANODE) J1.1 R10.1 R12.2 U7.1(VBAT) U7.13(VDDA) U7.19(VDD) U7.32(VDD) U7.48(VDD) U7.64(VDD)
GND: C3.1 C4.1 C5.1 C6.1 C7.1 C8.1 C9.1 C10.1 C11.1 C12.1 C13.1 C14.1 C17.1 C20.1 D2.2(K) J1.3 J1.5 R3.2 S1.1 S2.1 U7.12(VSSA) U7.18(VSS) U7.31(VSS) U7.47(VSS) U7.63(VSS) Y1.2(GND)
5V_ADC_INPUT: U7.9(PC1) ; port 5V_ADC_INPUT
BUTTON_1: C20.2 R10.2 S2.2 U7.17(PA3)
ENC_CS_3V3: U7.24(PC4) ; port ENC_CS_3V3
JTDI: J1.8 U7.50(PA15(JTDI))
JTDO/TRACESWO: J1.6 U7.55(PB3(JTDO/TRACESWO))
LED_1: R6.1 U7.38(PC7)
LED_B_n: R8.2 U7.15(PA1)
LED_G_n: R11.2 U7.14(PA0-WKUP(PA0))
LED_R_n: R9.1 U7.16(PA2)
NRST: C5.2 J1.10 R12.1 S1.2 U7.7(NRST)
PITCH_SERVO_PWM: U7.56(PB4(NJTRST)) ; port PITCH_SERVO_PWM
ROLL_SERVO_PWM: U7.57(PB5) ; port ROLL_SERVO_PWM
SWD_CLK: J1.4 U7.49(PA14(JTCK-SWCLK))
SWD_IO: J1.2 U7.46(PA13(JTMS-SWDIO))
YAW_SERVO_PWM: U7.58(PB6) ; port YAW_SERVO_PWM
NetC3_2: C3.2 U7.6(PH1-OSC_OUT(PH1)) Y1.1(HOT)
NetC4_2: C4.2 U7.5(PH0-OSC_IN(PH0)) Y1.3(HOT)
NetC6_2: C6.2 U7.30(VCAP_1)
NetD2_1: D2.1(A) R6.2
NetD4_1: D4.1(CATHODE_(RED)) R9.2
NetD4_2: D4.2(CATHODE_(GREEN)) R11.1
NetD4_3: D4.3(CATHODE_(BLUE)) R8.1
NetR3_1: R3.1 U7.60(BOOT0)
NetR13_1: R13.1 TP1.1(=value) ; port SPI_3V3.SCK_3V3
NetR13_2: R13.2 U7.21(PA5)
NetTP2_1: TP2.1(=value) U7.22(PA6) ; port SPI_3V3.MISO_3V3
NetU1_1: U7.45(PA12) ; port CANA_UART.CAN_TX_A
NetU1_4: U7.44(PA11) ; port CANA_UART.CAN_RX_A
NetU2_1: U7.34(PB13) ; port CANB_UART.CAN_TX_B
NetU2_4: U7.33(PB12) ; port CANB_UART.CAN_RX_B

Not connected (* = marked no-connect by the designer): J1 7* 9*; U7 2(PC13)* 3(PC14-OSC32_IN(PC14))* 4(PC15-OSC32_OUT(PC15))* 8(PC0)* 10(PC2)* 11(PC3)* 20(PA4)* 23(PA7)* 25(PC5)* 26(PB0)* 27(PB1)* 28(PB2-BOOT1(PB2))* 29(PB10)* 35(PB14)* 36(PB15)* 37(PC6)* 39(PC8)* 40(PC9)* 41(PA8)* 42(PA9)* 43(PA10)* 51(PC10)* 52(PC11)* 53(PC12)* 54(PD2)* 59(PB7)* 61(PB8)* 62(PB9)*; Y1 4(NC)*

### Notes on the sheet
- Status/Debug LEDs
- 4xVDD pin caps
- Decoupling Caps
- VDDIO pin caps
- VDDA pin caps
- (near Y1) STM32F446RET6
- Current Calculations
  Green LED voltage drop: 2.2V
  - I = (3.3-2.2V)/120 = 9.17mA
  RGB LED voltage drops:
  - Red: 2.1V: I = (3.3-2.1V)/120 = 10mA
  - Blue: 3.1V: I = (3.3-3.1V)/20 = 10mA
  - Green: 3.1V: I = (3.3-3.1V)/20 = 10mA
- Debug/Programming
- Title:
- Project:
- Date:
- Rev:
- Checker:
- Engineer:
- Sheet:
- of

### Library data of the parts
C3 C4 = CAP_14pF_50V_0603: CAP CER 14PF 50V C0G/NP0 0603; Manufacturer 1: Samsung; Manufacturer Part Number 1: CL10C140JB8NNNC; Dielectric: C0G; Voltage Rating: 50V; Supplier Part Number 1: 1276-2187-1-ND; Supplier 1: Digi-Key; Mounting Type: SMD
C5 C20 = CAP_1uF_16V_0805: CAP CER 1UF 16V X7R 0805; Manufacturer 1: Yageo; Manufacturer Part Number 1: CC0805KKX7R7BB105; Tolerance: 10%; Package/Footprint: 0805; Mount: Surface Mount; Case Code (Metric): 2012; Case Code (Imperial): 0805; Min Operating Temperature: -55°C; Max Operating Temperature: 125°C; Dielectric: X7R; Supplier 1: Digi-Key; Supplier Part Number 1: 311-1365-1-ND; Mounting Type: SMD
C6 C12 = CAP_4.7uF_16V_0805: CAP CER 4.7UF 16V X5R 0805; Manufacturer Part Number 1: CL21A475KOFNNNE; Manufacturer 1: Samsung Electro-Mechanics; Package/Footprint: 0805; Supplier Part Number 1: 1276-1065-1-ND; Supplier 1: Digi-Key; Dielectric: X5R; Mounting Type: SMD; LCSC Part #: C1779
C7 = CAP_1uF_16V_0603: CAP CER 1UF 16V Y5V 0603; Manufacturer Part Number: CC0603ZRY5V7BB105; Manufacturer 1: Yageo; Package/Footprint: 0603; Dimensions: 0.063" L x 0.031" W (1.60mm x 0.80mm); Package: 0603 (1608 Metric); Temperature Coefficient: Y5V; Supplier Part Number 1: 311-1372-1-ND; Supplier 1: Digi-Key; Manufacturer Part Number 1: CC0603ZRY5V7BB105; Dielectric: Y5V; Mounting Type: SMD
C8-C11 C13 C17 = CAP_0.1uF_50V_0603: as C27 on sheet SH2 - CONNECTORS; Temperature Coefficient: X7R; Supplier Part Number 1: 311-1344-1-ND; Supplier 1: Digi-Key; Dielectric: X7R; Mounting Type: SMD
C14 = CAP_10nF_0603: CAP CER 10000PF 16V X7R 0603; Manufacturer Part Number 1: CC0603KRX7R7BB103; Manufacturer 1: Yageo; Package/Footprint: 0603; Supplier Part Number 1: 311-3369-1-ND; Supplier 1: Digi-Key; Dielectric: X7R; Mounting Type: SMD
D2 = DIO_LED_G: LED GREEN DIFFUSED 0805 SMD; Manufacturer Part Number 1: LG R971-KN-1; Manufacturer 1: OSRAM; Forward Voltage Drop: 2.2V; Package/Footprint: 0805; Supplier Part Number 1: 475-1410-1-ND; Supplier 1: Digi-Key; Mounting Type: SMD
D4 = LED_RGB: LED RGB DIFFUSED 4PLCC SMD; Manufacturer 1: Broadcom; Color: Blue,Green,Red; Lens Color: White; Viewing Angle: 115°; Lens Style: Round; Luminous Intensity: 350mcd; Dominant Wavelength: 470nm; Forward Voltage: 3.1V; Test Current: 20mA; Package/Footprint: 4-PLCC; Supplier 1: Digi-Key; Case/Package: PLCC; Number of Pins: 4; Lens Transparency: Diffused; Length: 3.2mm; Height: 1.9mm; Width: 2.8mm; Supplier Part Number 1: 516-3280-1-ND; Mounting Type: SMD
J1 = CON_PROGRAMMING: CONN HEADER SMD 10POS 1.27MM; Manufacturer 1: Samtec; Max Current Rating: 1.75A; Supplier 1: Digi-Key; Pitch: 1.27mm; Supplier Part Number 1: SAM8796-ND; Mounting Type: SMD; Package/Footprint: SMD
MH1-MH4 = MOUNTING_HOLE_M3_GIMBAL_REV2: MOUNTING_HOLE_M3 Gimbal Rev2
R3 R10 R12 = RES_10kΩ_0603_5%: RES 10K OHM 5% 1/10W 0603; Manufacturer 1: Yageo; Manufacturer Part Number 1: RC0603JR-0710KL; Package: 0603 (1608 Metric); Tolerance: 5%; Supplier Part Number 1: 311-10KGRCT-ND; Supplier 1: Digi-Key; Case Code (Metric): 1608; Mounting Type: SMD
R6 R9 = RES_120Ω_0603_5%: as R4 on sheet SH1 - POWER; Package: 0603 (1608 Metric); Supplier Part Number 1: 311-120GRCT-ND; Supplier 1: Digi-Key; Mounting Type: SMD
R8 R11 = RES_20Ω_0603_5%: RES 20 OHM 5% 1/10W 0603; Manufacturer 1: Yageo; Manufacturer Part Number 1: RC0603JR-0720RL; Package: 0603 (1608 Metric); Dimensions: 0.063" L x 0.031" W (1.60mm x 0.80mm); Tolerance: 5%; Supplier Part Number 1: 311-20GRCT-ND; Supplier 1: Digi-Key; Mounting Type: SMD
R13 = RES_27Ω_0603_5%: RES 27 OHM 5% 1/10W 0603; Manufacturer Part Number 1: RC0603JR-0727RL; Manufacturer 1: Yageo; Supplier 1: Digi-Key; Supplier Part Number 1: 311-27GRCT-ND; Tolerance: 5%; Mounting Type: SMD
S1 S2 = SW_TACTILE: SWITCH TACTILE SPST-NO 0.05A 12V; Manufacturer 1: Omron Electronics Inc-EMC Div; Package/Footprint: SMD; Manufacturer Part Number 1: B3U-1000P; Supplier 1: Digi-Key; Supplier Part Number 1: SW1020CT-ND; Mounting Type: SMD
TP1 TP2 = TESTPOINT_1MM_CIRCLE: TESTPOINT 1MM CIRCLE; Part Number (MPN): *
U7 = MCU_STM32F446RET6: ARM Cortex-M4 32-bit MCU+FPU, 512 KB Flash, 128 KB Internal RAM, 50 I/Os, 64-Pin LQFP, -40 to 85 degC, Tray; I/Os (High Current): 50; Supply Voltage(Vcc) min (V): 1.7; Operating Frequency(F) (Processor speed) (MHz): 180; D/A Converter: 2; Internal RAM Size (kB): 128; FLASH Size (Prog) (kB): 512; Core: ARM Cortex-M4; ComponentLink1Description: Manufacturer URL; Package Reference: 64-Pin Low-profile Quad Flat Package, Body 10 x 10 mm, Pitch 0.5 mm; ComponentLink2URL: http://www.st.com/st-web-ui/static/active/en/resource/technical/document/datasheet/DM00141306.pdf; Packing: Tray; DatasheetVersion: Rev. 6; ComponentLink1URL: http://www.st.com/; ComponentLink2Description: Datasheet; Package Description: LQFP64; Mounting Technology: Surface Mount; Supplier Part Number 1: 497-15376-ND; Supplier 1: Digi-Key
Y1 = CRYSTAL_25MHZ: CRYSTAL 25.0000MHZ 12PF SMD; Manufacturer 1: Kyocera AVX; Supplier 1: Digi-Key; Supplier Part Number 1: 1253-1724-1-ND; Load Capacitance: 12pF; Mounting Type: SMD; Package/Footprint: SMD

## Sheet SH6 - CAN.SchDoc: CAN
size B; CheckedBy: Lance Bantoto; Author: Aidan Gratton; Engineer: Aidan Gratton; Organization: UW Robotics; Address1: 200 University Avenue; Address2: Waterloo; Address3: Ontario; Address4: Canada N2L 3G6; Revision: 2; SheetNumber: 6; SheetTotal: 6
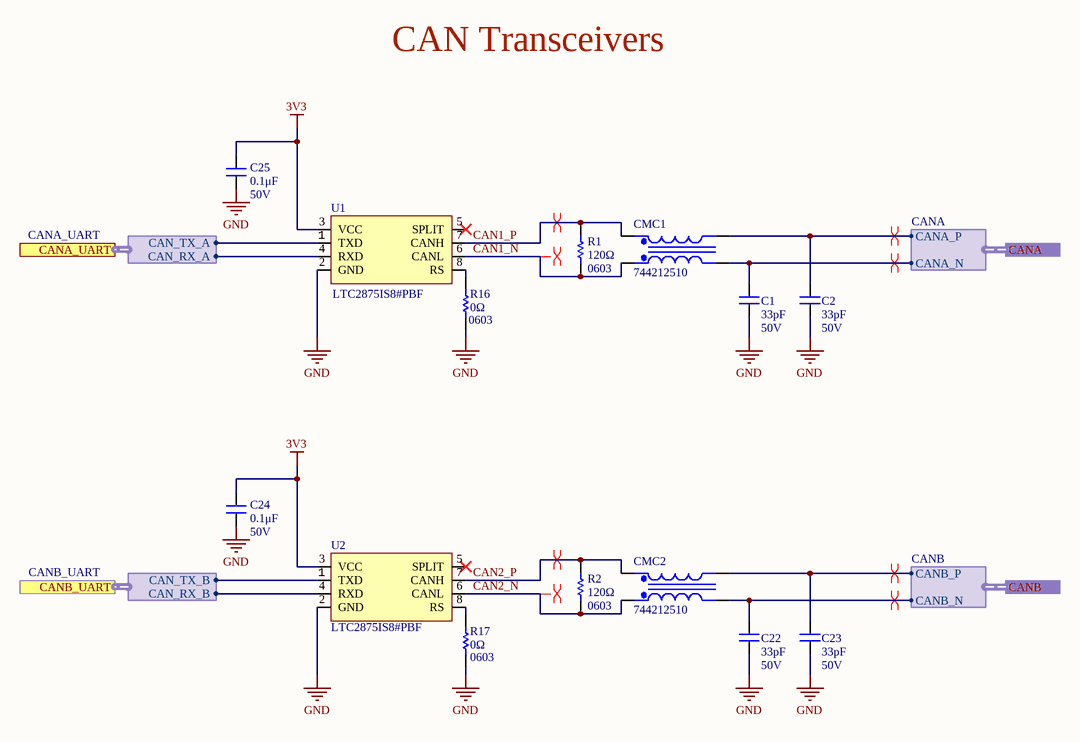
[diagram p4: SH6 - CAN.SchDoc]

### Parts
C1  value 33pF  Voltage: 50V  [CAP0603]  (hidden comment: CAP_33pF_50V_0603)
C2  value 33pF  Voltage: 50V  [CAP0603]  (hidden comment: CAP_33pF_50V_0603)
C22  value 33pF  Voltage: 50V  [CAP0603]  (hidden comment: CAP_33pF_50V_0603)
C23  value 33pF  Voltage: 50V  [CAP0603]  (hidden comment: CAP_33pF_50V_0603)
C24  value 0.1μF  Voltage Rating: 50V  [CAP0603]  (hidden comment: CAP_0.1uF_50V_0603)
C25  value 0.1μF  Voltage Rating: 50V  [CAP0603]  (hidden comment: CAP_0.1uF_50V_0603)
CMC1  CMC_51uH  [744212510]  (value not drawn)
CMC2  CMC_51uH  [744212510]  (value not drawn)
R1  value 120Ω  Case Code (Imperial): 0603  [RESC0603(1608)_N]  (hidden comment: RES_120Ω_0603)
R2  value 120Ω  Case Code (Imperial): 0603  [RESC0603(1608)_N]  (hidden comment: RES_120Ω_0603)
R16  value 0Ω  Case Code (Imperial): 0603  [RESC0603(1608)_N]  (hidden comment: RES_0Ω_0603)
R17  value 0Ω  Case Code (Imperial): 0603  [RESC0603(1608)_N]  (hidden comment: RES_0Ω_0603)
U1  Manufacturer Part Number 1: LTC2875IS8#PBF  [LT-S8_N]  (hidden comment: IC TXRX CAN)
U2  Manufacturer Part Number 1: LTC2875IS8#PBF  [LT-S8_N]  (hidden comment: IC TXRX CAN)

### Ports
CANA (harness CANA), CANA_UART (harness CANA_UART), CANB (harness CANB), CANB_UART (harness CANB_UART)

### Harnesses
CANA_UART: CAN_RX_A, CAN_TX_A
CANA: CANA_N, CANA_P
CANB: CANB_N, CANB_P
CANB_UART: CAN_RX_B, CAN_TX_B

### Nets
3V3: C24.1 C25.1 U1.3(VCC) U2.3(VCC)
GND: C1.1 C2.1 C22.1 C23.1 C24.2 C25.2 R16.1 R17.1 U1.2(GND) U2.2(GND)
CAN1_N: CMC1.1(Pri+) R1.1 U1.6(CANL)
CAN1_P: CMC1.3(Sec+) R1.2 U1.7(CANH)
CAN2_N: CMC2.1(Pri+) R2.1 U2.6(CANL)
CAN2_P: CMC2.3(Sec+) R2.2 U2.7(CANH)
CANA_N: C1.2 CMC1.5(Pri-) ; port CANA.CANA_N
CANA_P: C2.2 CMC1.4(Sec-) ; port CANA.CANA_P
CANB_N: C22.2 CMC2.5(Pri-) ; port CANB.CANB_N
CANB_P: C23.2 CMC2.4(Sec-) ; port CANB.CANB_P
NetR16_2: R16.2 U1.8(RS)
NetR17_2: R17.2 U2.8(RS)
NetU1_1: U1.1(TXD) ; port CANA_UART.CAN_TX_A
NetU1_4: U1.4(RXD) ; port CANA_UART.CAN_RX_A
NetU2_1: U2.1(TXD) ; port CANB_UART.CAN_TX_B
NetU2_4: U2.4(RXD) ; port CANB_UART.CAN_RX_B

Not connected (* = marked no-connect by the designer): U1 5(SPLIT)*; U2 5(SPLIT)*

### Layout directives
differential pair: CAN1_N, CAN1_P, CAN2_N, CAN2_P, CANA_N, CANA_P, CANB_N, CANB_P

### Notes on the sheet
- CAN Transceivers
- Title:
- Project:
- Date:
- Rev:
- Checker:
- Engineer:
- Sheet:
- of

### Library data of the parts
C1 C2 C22 C23 = CAP_33pF_50V_0603: CAP CER 33PF 50V C0G/NP0; Manufacturer 1: Yageo; Manufacturer Part Number 1: CC0603JRNPO9BN330; Dielectric Material: Ceramic; Temperature Coefficient: 30ppm/°C; Tolerance: 5%; Dielectric: C0G; Insulation Resistance: 100GR; Supplier 1: Digi-Key; Mount: Surface Mount; Number of Pins: 2; Case Code (Metric): 1608; Min Operating Temperature: -55°C; Max Operating Temperature: 125°C; Termination: SMD/SMT; Composition: Ceramic; Voltage Rating: 50V; Voltage Rating (DC): 50V; Length: 1.6mm; Height: 0.8mm; Thickness: 0.035inch; Depth: 0.8mm; Width: 0.031inch; REACH SVHC: No SVHC; ComponentLink7URL: https://datasheet.ciiva.com/11464/upy-gp-np0-16v-to-50v-8-11464730.pdf?src-supplier=Avnet; ComponentLink7Description: https://datasheet.ciiva.com/11464/upy-gp-np0-16v-to-50v-8-11464730.pdf?src-supplier=Avnet; ComponentLink8URL: https://datasheet.ciiva.com/46430/1835847-46430155.pdf?src-supplier=Element14; ComponentLink8Description: https://datasheet.ciiva.com/46430/1835847-46430155.pdf?src-supplier=Element14; ComponentLink9URL: https://datasheet.ciiva.com/144/mlccorderingcode-144644.pdf?src-supplier=Digi-Key; ComponentLink9Description: https://datasheet.ciiva.com/144/mlccorderingcode-144644.pdf?src-supplier=Digi-Key; ComponentLink10URL: https://datasheet.ciiva.com/5426/upy-gp-np0-16v-to-50v-8-5426614.pdf?src-supplier=Mouser; ComponentLink10Description: https://datasheet.ciiva.com/5426/upy-gp-np0-16v-to-50v-8-5426614.pdf?src-supplier=Mouser; ComponentLink11URL: https://datasheet.ciiva.com/7978/1443161-7978142.pdf?src-supplier=Element14; ComponentLink11Description: https://datasheet.ciiva.com/7978/1443161-7978142.pdf?src-supplier=Element14; Supplier Part Number 1: 311-1064-1-ND; Package: 0603; Case Code (Imperial): 0603
C24 C25 = CAP_0.1uF_50V_0603: as C18 on sheet SH3 - SENSORS; Dimensions: 0.063" L x 0.031" W (1.60mm x 0.80mm); Package: 0603 (1608 Metric); Temperature Coefficient: X7R; Supplier Part Number 1: 311-1344-1-ND; Supplier 1: Digi-Key; Mount: Surface Mount; Case Code (Imperial): 0603; Case Code (Metric): 1608; Dielectric: X7R
CMC1 CMC2 = CMC_51uH: CMC 51uH 300MA 2LN SMD; Manufacturer 1: Wurth Electronics; Core Material: Ferrite; DC Resistance (DCR): 160mR; Test Frequency: 100kHz; Inductance Tolerance: 50%; Voltage Rating (DC): 80V; Number of Lines: 2; Impedance: 300R; Supplier 1: Digi-Key; Manufacturer Part Number 1: 744212510; Mount: Surface Mount; Case/Package: SMD/SMT; Number of Pins: 4; Min Operating Temperature: -40°C; Max Operating Temperature: 105°C; Current: 300mA; Max DC Current: 300mA; Termination: SMD/SMT; Current Rating: 300mA; Inductance: 51uH; Tolerance: 50%; Length: 6.5mm; Height: 1.65mm; Depth: 3.6mm; Width: 0.142inch; REACH SVHC: No SVHC; ComponentLink7URL: https://datasheet.ciiva.com/6216/744212510-6216348.pdf?src-supplier=Digi-Key; ComponentLink7Description: https://datasheet.ciiva.com/6216/744212510-6216348.pdf?src-supplier=Digi-Key; ComponentLink8URL: https://datasheet.ciiva.com/7764/1735560-7764951.pdf?src-supplier=Element14; ComponentLink8Description: https://datasheet.ciiva.com/7764/1735560-7764951.pdf?src-supplier=Element14; Supplier Part Number 1: 732-3941-1-ND
R1 R2 = RES_120Ω_0603_5%: as R4 on sheet SH1 - POWER; Package: 0603 (1608 Metric); Dimensions: 0.063" L x 0.031" W (1.60mm x 0.80mm); Supplier Part Number 1: 311-120GRCT-ND; Supplier 1: Digi-Key; Mount: Surface Mount; Case Code (Metric): 1608; Tolerance: 5%
R16 R17 = RES_0Ω_0603: RES 0 OHM JUMPER 1/10W 0603; Manufacturer 1: Yageo; Manufacturer Part Number 1: RC0603JR-070RL; Package: 0603 (1608 Metric); Dimensions: 0.063" L x 0.031" W (1.60mm x 0.80mm); Supplier Part Number 1: 311-0.0GRCT-ND; Supplier 1: Digi-Key; Mount: Surface Mount; Case Code (Metric): 1608
U1 U2 = LTC2875: IC TXRX CAN 4MBPS 8SO; Manufacturer 1: Linear Technologies; Package: 8-SOIC (0.154", 3.90mm Width); Supplier Part Number 1: LTC2875IS8#PBF-ND; Supplier 1: Digi-Key; Mount: Surface Mount

## Nets that join several sheets
3V3: SH1 - POWER (6 pins), SH3 - SENSORS (C18.2 R14.2 R15.2 U4.1), SH5 - MICROCONTROLLER (19 pins), SH6 - CAN (C24.1 C25.1 U1.3 U2.3)
5V: SH1 - POWER (7 pins), SH2 - CONNECTORS (F2.2 F3.2 F4.2 F7.2), SH3 - SENSORS (C19.2 R18.2 U4.14)
GND: SH1 - POWER (14 pins), SH2 - CONNECTORS (20 pins), SH3 - SENSORS (C18.1 C19.1 R19.1 U4.7), SH5 - MICROCONTROLLER (26 pins), SH6 - CAN (10 pins)
5V_ADC_INPUT: SH3 - SENSORS (R18.1 R19.2), SH5 - MICROCONTROLLER (U7.9)
CANA_N: SH2 - CONNECTORS (D8.1 J6.1 J6.5), SH6 - CAN (C1.2 CMC1.5)
CANA_P: SH2 - CONNECTORS (D8.2 J6.2 J6.4), SH6 - CAN (C2.2 CMC1.4)
CANB_N: SH2 - CONNECTORS (D9.1 J7.1 J7.5), SH6 - CAN (C22.2 CMC2.5)
CANB_P: SH2 - CONNECTORS (D9.2 J7.2 J7.4), SH6 - CAN (C23.2 CMC2.4)
ENC_CS_3V3: SH3 - SENSORS (R14.1 TP15.1 U4.5), SH5 - MICROCONTROLLER (U7.24)
NetJ4_2: SH2 - CONNECTORS (J4.2), SH3 - SENSORS (U4.13)
NetJ4_3: SH2 - CONNECTORS (J4.3), SH3 - SENSORS (U4.12)
NetJ4_4: SH2 - CONNECTORS (J4.4), SH3 - SENSORS (U4.10)
NetR13_1: SH3 - SENSORS (U4.2), SH5 - MICROCONTROLLER (R13.1 TP1.1)
NetTP2_1: SH3 - SENSORS (U4.3), SH5 - MICROCONTROLLER (TP2.1 U7.22)
NetU1_1: SH5 - MICROCONTROLLER (U7.45), SH6 - CAN (U1.1)
NetU1_4: SH5 - MICROCONTROLLER (U7.44), SH6 - CAN (U1.4)
NetU2_1: SH5 - MICROCONTROLLER (U7.34), SH6 - CAN (U2.1)
NetU2_4: SH5 - MICROCONTROLLER (U7.33), SH6 - CAN (U2.4)
PITCH_SERVO_PWM: SH2 - CONNECTORS (J3.1 TP8.1), SH5 - MICROCONTROLLER (U7.56)
ROLL_SERVO_PWM: SH2 - CONNECTORS (J8.1 TP10.1), SH5 - MICROCONTROLLER (U7.57)
YAW_SERVO_PWM: SH2 - CONNECTORS (J5.1 TP9.1), SH5 - MICROCONTROLLER (U7.58)